# EAGLE schematic communication-hub (EAGLE 9.5.1)
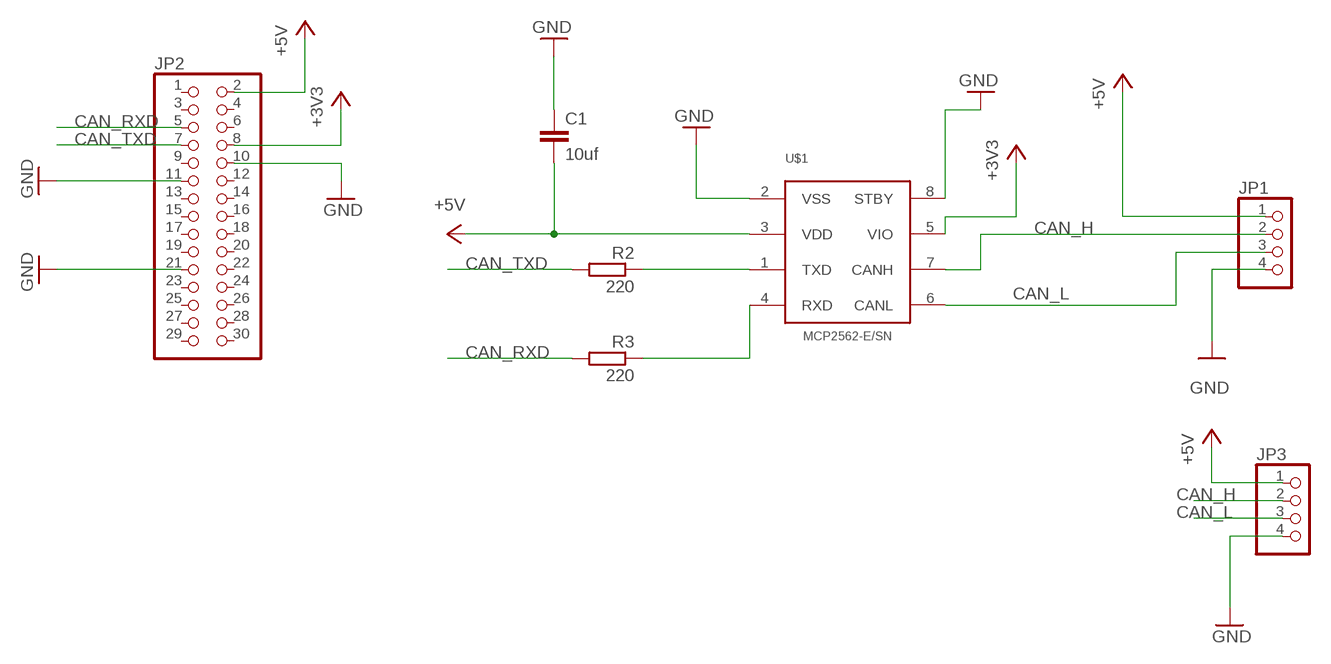
[diagram p0: schematic, sheet 1]

## Parts
C1  10uf  C-EUC0805  [C0805]
JP1  PINHD-1X4  [1X04]
JP2  PINHD-2X15  [2X15]
JP3  PINHD-1X4  [1X04]
R2  220  R-EU_R0805  [R0805]
R3  220  R-EU_R0805  [R0805]
U$1  MCP2562-E/SN  [SOIC8]

## Nets
+3V3: JP2.8 U$1.5(VIO)
+5V: C1.2 JP1.1 JP2.2 JP3.1 U$1.3(VDD)
CAN_H: JP1.2 JP3.2 U$1.7(CANH)
CAN_L: JP1.3 JP3.3 U$1.6(CANL)
CAN_RXD: JP2.5 R3.2
CAN_TXD: JP2.7 R2.2
GND: C1.1 JP1.4 JP2.10 JP2.11 JP2.21 JP3.4 U$1.2(VSS) U$1.8(STBY)
N$3: R3.1 U$1.4(RXD)
N$4: R2.1 U$1.1(TXD)
Unconnected: JP2.1 JP2.3 JP2.4 JP2.6 JP2.9 JP2.12 JP2.13 JP2.14 JP2.15 JP2.16 JP2.17 JP2.18 JP2.19 JP2.20 JP2.22 JP2.23 JP2.24 JP2.25 JP2.26 JP2.27 JP2.28 JP2.29 JP2.30

## Library data of the parts
C1 = rcl:C-EU: CAPACITOR, European symbol; SPICEPREFIX: C
JP1 JP3 = pinhead:PINHD-1X4: PIN HEADER
JP2 = pinhead:PINHD-2X15: PIN HEADER
R2 R3 = rcl:R-EU_: RESISTOR, European symbol; SPICEPREFIX: R
U$1 = SPEAR-general:MCP2562-E/SN: CAN Bus Transciever